# Altium schematic sheet senseinterface.SchDoc: Senseinterface
size A4 portrait; DocumentNumber: 8; Revision: betaV1.0; SheetNumber: 8; SheetTotal: 8; Organization: 合肥弗雷电子; Address1: 玉兰大道14号D栋3楼; Address2: 肥西县桃花镇; Address3: 合肥市; Address4: 安徽省
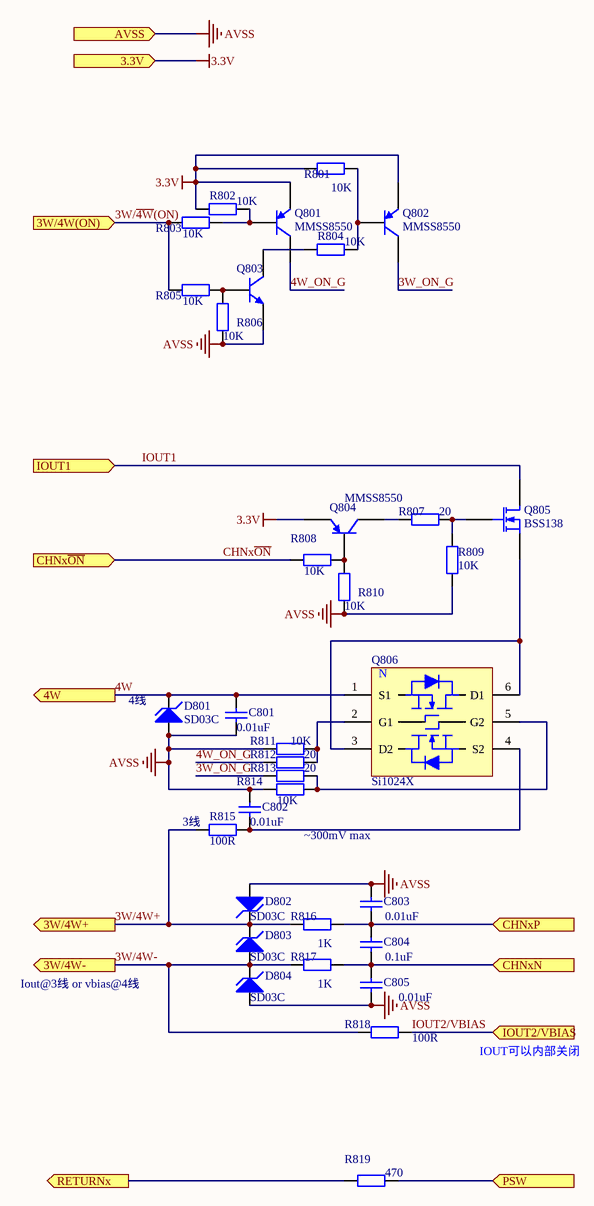
[diagram p0: senseinterface.SchDoc]

## Parts
C801  value 0.01uF  [0805c]  (hidden comment: CC0805MRX7R9BB103)
C802  value 0.01uF  [0805c]  (hidden comment: CC0805MRX7R9BB103)
C803  value 0.01uF  [0805c]  (hidden comment: CC0805MRX7R9BB103)
C804  value 0.1uF  [0805c]  (hidden comment: CC0805MRX7R9BB104)
C805  value 0.01uF  [0805c]  (hidden comment: CC0805MRX7R9BB103)
D801  SD03C  [sod323]
D802  SD03C  [sod323]
D803  SD03C  [sod323]
D804  SD03C  [sod323]
Q801  MMSS8550  [SOT-23-BJT]
Q802  MMSS8550  [SOT-23-BJT]
Q803  MMSS8050  [SOT-23-BJT]  (value not drawn)
Q804  MMSS8550  [SOT-23-BJT]
Q805  BSS138  [E3]
Q806  Si1024X  [SOT563F(SC-89-6)]
R801  value 10K  [0805R]  (hidden comment: RC0805JR-0710KL)
R802  value 10K  [0805R]  (hidden comment: RC0805JR-0710KL)
R803  value 10K  [0805R]  (hidden comment: RC0805JR-0710KL)
R804  value 10K  [0805R]  (hidden comment: RC0805JR-0710KL)
R805  value 10K  [0805R]  (hidden comment: RC0805JR-0710KL)
R806  value 10K  [0805R]  (hidden comment: RC0805JR-0710KL)
R807  value 20  [0805R]  (hidden comment: RC0805JR-0720RL)
R808  value 10K  [0805R]  (hidden comment: RC0805JR-0710KL)
R809  value 10K  [0805R]  (hidden comment: RC0805JR-0710KL)
R810  value 10K  [0805R]  (hidden comment: RC0805JR-0710KL)
R811  value 10K  [0805R]  (hidden comment: RC0805JR-0710KL)
R812  value 20  [0805R]  (hidden comment: RC0805JR-0720RL)
R813  value 20  [0805R]  (hidden comment: RC0805JR-0720RL)
R814  value 10K  [0805R]  (hidden comment: RC0805JR-0710KL)
R815  value 100R  [0805R]  (hidden comment: RC0805JR-07100RL)
R816  value 1K  [0805R]  (hidden comment: RC0805JR-071KL)
R817  value 1K  [0805R]  (hidden comment: RC0805JR-071KL)
R818  value 100R  [0805R]  (hidden comment: RC0805JR-07100RL)
R819  value 470  [0805R]  (hidden comment: RC0805JR-07470RL)

## Ports
3.3V (in), 3W/4W(ON) (in), 3W/4W+ (out), 3W/4W- (out), 4W (out), AVSS (in), CHNxN (in), CHNxP (in), CHNx~{ON} (in), IOUT1 (in), IOUT2/VBIAS (in), PSW (in), RETURNx (out)

## Nets
3.3V: Q801.3(E) Q802.3(E) Q804.3(E) R801.2 R802.2 ; port 3.3V
AVSS: C801.2 C802.1 C803.2 C805.2 D801.1(ANODE) D802.1(ANODE) D804.1(ANODE) Q803.3(E) R806.2 R809.2 R810.2 R811.1 R814.1 ; port AVSS
3W/~{4W}(ON): R803.2 R805.2 ; port 3W/4W(ON)
3W/4W+: D802.2(CATHODE) D803.2(CATHODE) R815.1 R816.2 ; port 3W/4W+
3W/4W-: D803.1(ANODE) D804.2(CATHODE) R817.2 R818.2 ; port 3W/4W-
3W_ON_G: Q802.1(C) R813.1
4W: C801.1 D801.2(CATHODE) Q806.1(S1) ; port 4W
4W_ON_G: Q801.1(C) R812.1
CHNxN: C804.2 C805.1 R817.1 ; port CHNxN
CHNx~{ON}: R808.2 ; port CHNx~{ON}
CHNxP: C803.1 C804.1 R816.1 ; port CHNxP
IOUT1: Q805.1(D) ; port IOUT1
IOUT2/VBIAS: R818.1 ; port IOUT2/VBIAS
PSW: R819.1 ; port PSW
RETURNx: R819.2 ; port RETURNx
NetC802_2: C802.2 Q806.4(S2) R815.2
NetQ801_2: Q801.2(B) R802.1 R803.1
NetQ802_2: Q802.2(B) R801.1 R804.1
NetQ803_1: Q803.1(C) R804.2
NetQ803_2: Q803.2(B) R805.1 R806.1
NetQ804_1: Q804.1(C) R807.1
NetQ804_2: Q804.2(B) R808.1 R810.1
NetQ805_2: Q805.2(G) R807.2 R809.1
NetQ805_3: Q805.3(S) Q806.3(D2) Q806.6(D1)
NetQ806_2: Q806.2(G1) R811.2 R812.2
NetQ806_5: Q806.5(G2) R813.2 R814.2

## Notes on the sheet
- (near D801) 4线
- (near R815) 3线
- ~300mV max
- Iout@3线 or vbias@4线
- IOUT可以内部关闭
- Title
- Size:
- Date:
- A4
- Number:
- Time:
- Revision:
- Sheet
- of
- File:
- (in symbol Si1024X) N

## Library data of the parts
C801-C805 = Cap: Capacitor; Published: 8-Jun-2000; LatestRevisionDate: 17-Jul-2002; LatestRevisionNote: Re-released for DXP Platform.; PackageReference: RAD-0.3; Publisher: Altium Limited; PackageDescription: Radial Cap, Thru-Hole; 2 Leads; 0.3 in Pin Spacing
D801-D804 = TVS DIODE
Q801 Q802 Q804 = PNP: PNP Bipolar Transistor; Published: 8-Jun-2000; LatestRevisionDate: 29-May-2009; LatestRevisionNote: IPC-7351 Footprint Added.; PackageVersion: Aug-1999; PackageReference: SOT-23B; Publisher: Altium Limited; PackageDescription: 3-Pin SOT-23 Package 0.95 mm Pitch, 2.4 mm Lead Span
Q803 = NPN: NPN Bipolar Transistor; Published: 8-Jun-2000; LatestRevisionDate: 17-Jul-2002; LatestRevisionNote: Re-released for DXP Platform.; PackageReference: TO-226-AA; Publisher: Altium Limited; PackageDescription: TO, Flat Index; 3 In-Line, Axial Leads; Body Dia. 4.8mm; Leads 0.55 x 0.51 mm (max); Code_JEDEC: TO-226-AA
Q805 = MOSFET-N: N-Channel MOSFET; Published: 8-Jun-2000; LatestRevisionDate: 17-Jul-2002; LatestRevisionNote: Re-released for DXP Platform.; PackageVersion: 1995/1996; PackageReference: E3; Publisher: Altium Limited; PackageDescription: TO, Flat Index; 3 In-Line, Axial Leads; Body Dia. 4.6mm; Lead Dia. 0.5 mm (max)
R801-R819 = Res2: Resistor; Published: 8-Jun-2000; LatestRevisionDate: 17-Jul-2002; LatestRevisionNote: Re-released for DXP Platform.; PackageReference: AXIAL-0.4; Publisher: Altium Limited; PackageDescription: Axial Device, Thru-Hole; 2 Leads; 0.4 in Pin Spacing